# EAGLE design Radio2_Cm (EAGLE 7.5.0)
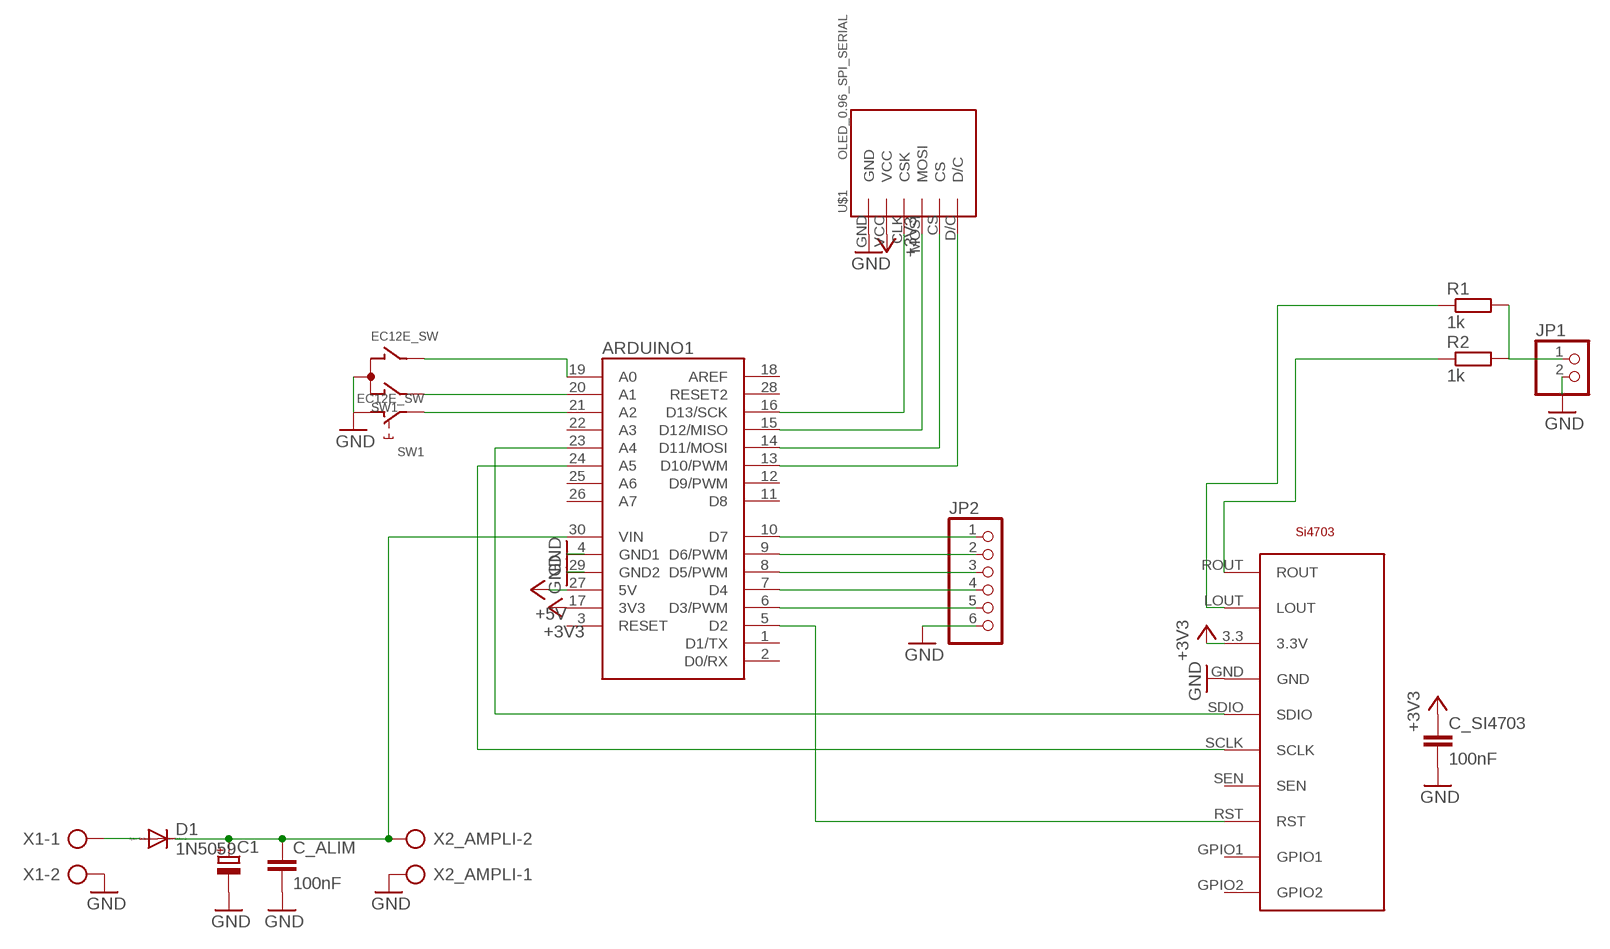
[diagram p0: schematic, sheet 1]

## Parts
ARDUINO1  ARDUINO_NANO  [ARDUINO_NANO]
C1  CPOL-EUE7.5-16  [E7,5-16]
C_ALIM  100nF  C-EU025-024X044  [C025-024X044]
C_SI4703  100nF  C-EU025-024X044  [C025-024X044]
D1  1N5059  [DO204-10]
JP1  PINHD-1X2  [1X02]
JP2  PINHD-1X6  [1X06]
R1  1k  R-EU_0207/10  [0207/10]
R2  1k  R-EU_0207/10  [0207/10]
SW1  EC12E_SW  [ALPS_EC12E_SW]
U$1  OLED_0.96_SPI_SERIAL  [OLED_9.96_SPI_SERIAL]
U$3  SI4703  [SI4703]
X1  AK300/2  [AK300/2]
X2_AMPLI  AK300/2  [AK300/2]

## Nets
+3V3: ARDUINO1.17(3V3) C_SI4703.1 U$1.VCC U$3.3.3(3.3V)
+5V: ARDUINO1.27(5V)
GND: ARDUINO1.4(GND1) ARDUINO1.29(GND2) C1.- C_ALIM.2 C_SI4703.2 JP1.2 JP2.6 SW1.C SW1.D U$1.GND U$3.GND X1.2 X2_AMPLI.1
N$1: ARDUINO1.16(D13/SCK) U$1.CLK(CSK)
N$2: ARDUINO1.5(D2) U$3.RST
N$3: ARDUINO1.6(D3/PWM) JP2.5
N$4: ARDUINO1.7(D4) JP2.4
N$5: ARDUINO1.8(D5/PWM) JP2.3
N$6: ARDUINO1.9(D6/PWM) JP2.2
N$7: ARDUINO1.15(D12/MISO) U$1.MOSI
N$8: ARDUINO1.14(D11/MOSI) U$1.CS
N$9: ARDUINO1.10(D7) JP2.1
N$10: ARDUINO1.23(A4) U$3.SDIO
N$11: D1.A X1.1
N$12: ARDUINO1.30(VIN) C1.+ C_ALIM.1 D1.C X2_AMPLI.2
N$13: R2.1 U$3.ROUT
N$14: R1.1 U$3.LOUT
N$17: JP1.1 R1.2 R2.2
N$20: ARDUINO1.13(D10/PWM) U$1.D/C
N$22: ARDUINO1.21(A2) SW1.E
N$25: ARDUINO1.20(A1) SW1.A
N$26: ARDUINO1.19(A0) SW1.B
N$55: ARDUINO1.24(A5) U$3.SCLK
Unconnected: ARDUINO1.1(D1/TX) ARDUINO1.2(D0/RX) ARDUINO1.3(RESET) ARDUINO1.11(D8) ARDUINO1.12(D9/PWM) ARDUINO1.18(AREF) ARDUINO1.22(A3) ARDUINO1.25(A6) ARDUINO1.26(A7) SW1.GND1(G) SW1.GND2(G) U$3.GPIO1 U$3.GPIO2 U$3.SEN

## Power pins joined to a net without a drawn wire
RESET2: ARDUINO1.28(RESET2)

## Library data of the parts
ARDUINO1 = arduino:ARDUINO_NANO: Arduino Nano I/O pin arrangement
C1 = rcl:CPOL-EU: POLARIZED CAPACITOR, European symbol
C_ALIM C_SI4703 = rcl:C-EU: CAPACITOR, European symbol
D1 = diode:1N5059: DIODE controlled avalanche rectifier
JP1 = pinhead:PINHD-1X2: PIN HEADER
JP2 = pinhead:PINHD-1X6: PIN HEADER
R1 R2 = rcl:R-EU_: RESISTOR, European symbol
SW1 = switch-alps:EC12E_SW: ALPS rotary Encoder EC12E series with switch; MPN: EC12E2424407; OC_FARNELL: 1520813; OC_NEWARK: 74M1068
U$1 = tft_1.8_1.44_oled_0.96:OLED_0.96_SPI_SERIAL
U$3 = Radio_mp3:SI4703
X1 X2_AMPLI = con-ptr500:AK300/2: CONNECTOR; OC_FARNELL: unknown; OC_NEWARK: unknown

## Board
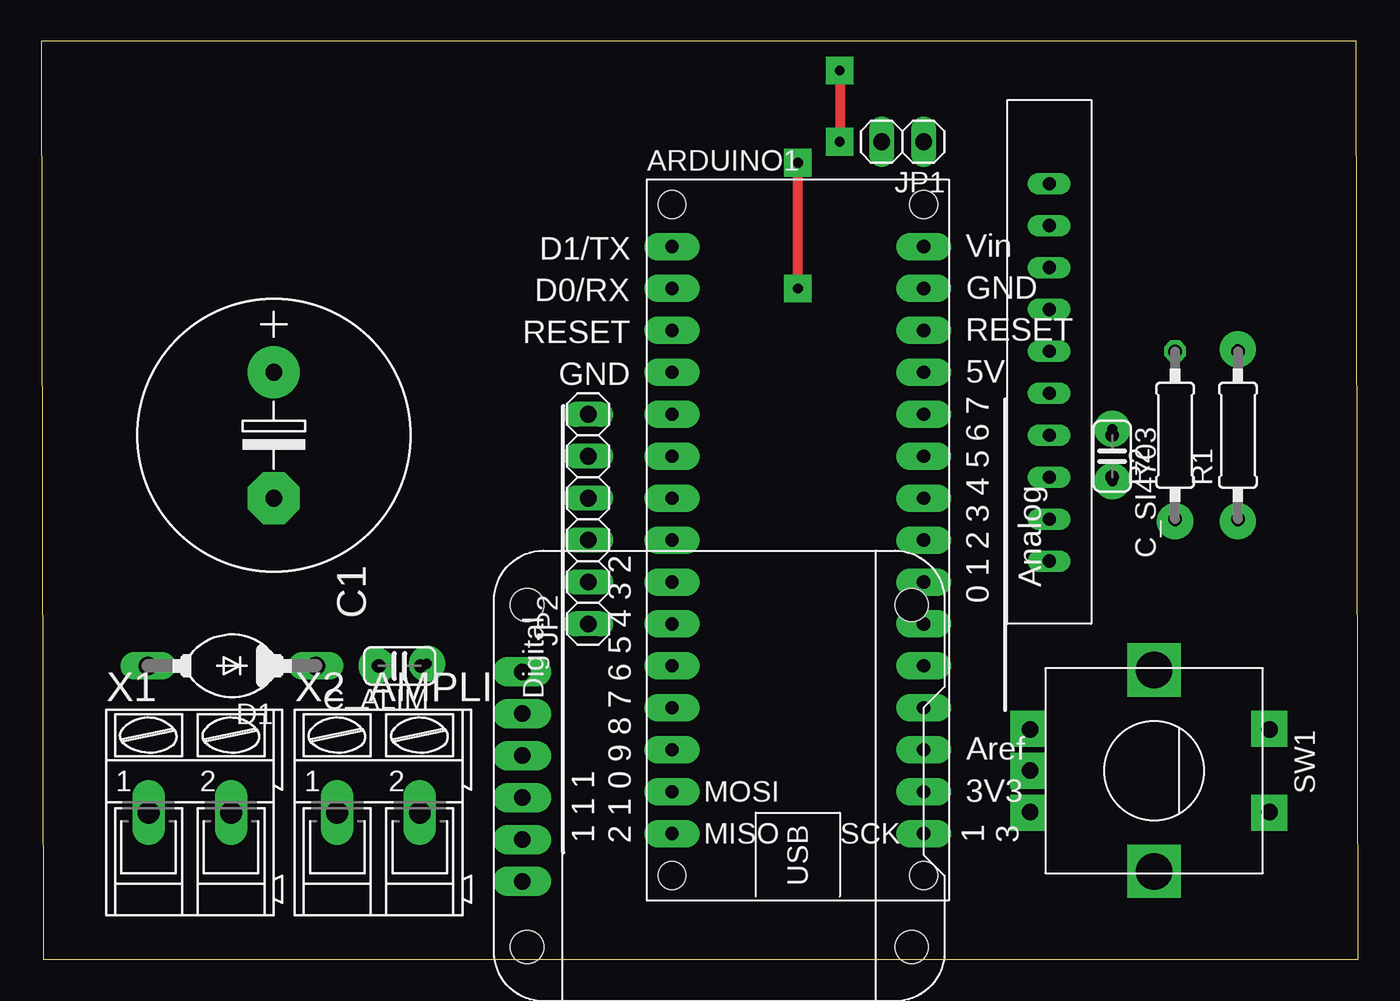
[diagram p1: board, top side]
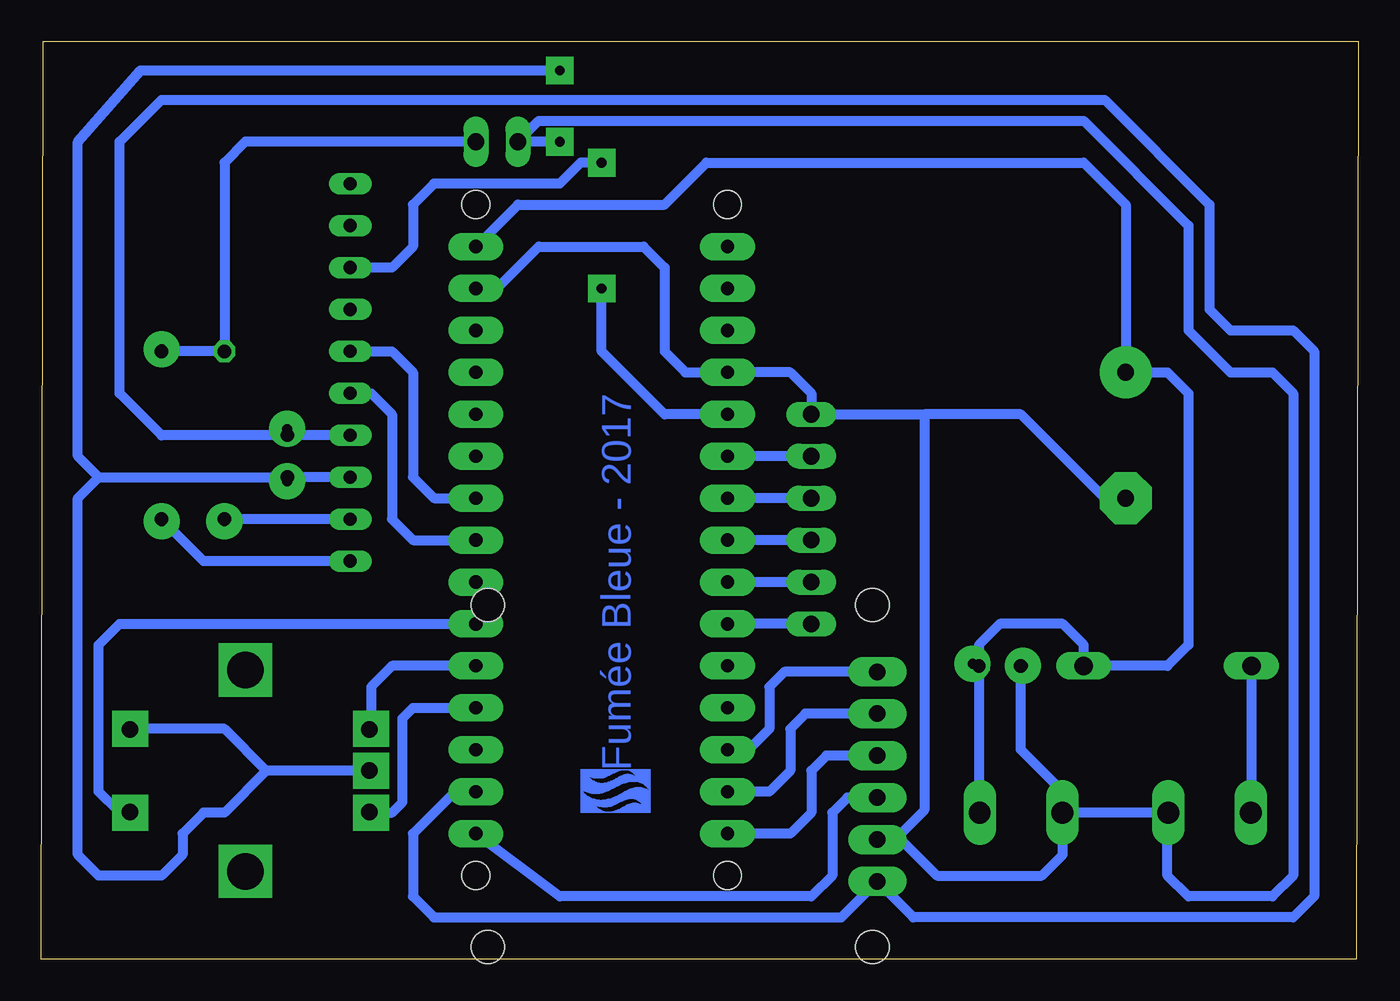
[diagram p2: board, bottom side, seen from below]

Size 79.81 x 55.62 mm. Coordinates in mm from the lower left corner, seen from the top.
Outline: 0.13,0 79.81,0 79.68,55.62 0,55.62 0.13,0
Copper layers (1*16): Top 0.035mm / dielectric 1.5mm / Bottom 0.035mm
Design rules "default": minimum track width 10mil, minimum drill 24mil, track to track 8mil, track to pad 8mil, pad to pad 8mil, via to via 8mil, smd to smd 8mil, copper to edge 40mil, drill to drill 8mil, minimum pad ring 10mil, minimum via ring 8mil, stop-mask expansion 4mil, vias tented up to drill 0mil, thermal gap 10mil

### Footprints (pad centres in the part's own frame; a part is rotated, then mirrored left to right if it is on the bottom)
ARDUINO_NANO = drill 0.8 pad 1.676 long: 1 0,-2.54; 2 0,-5.08; 3 0,-7.62; 4 0,-10.16; 5 0,-12.7; 6 0,-15.24; 7 0,-17.78; 8 0,-20.32; 9 0,-22.86; 10 0,-25.4; 11 0,-27.94; 12 0,-30.48; 13 0,-33.02; 14 0,-35.56; 15 0,-38.1; 16 15.24,-38.1; 17 15.24,-35.56; 18 15.24,-33.02; 19 15.24,-30.48; 20 15.24,-27.94; 21 15.24,-25.4; 22 15.24,-22.86; 23 15.24,-20.32; 24 15.24,-17.78; 25 15.24,-15.24; 26 15.24,-12.7; 27 15.24,-10.16; 28 15.24,-7.62; 29 15.24,-5.08; 30 15.24,-2.54 | hole 1.676: 0,0; 0,-40.64; 15.24,-40.64; 15.24,0
E7,5-16 = drill 1.016 pad 3.15: + -3.81,0 | drill 1.016 pad 3.15 octagon: - 3.81,0
C025-024X044 = drill 0.813 octagon: 1 -1.27,0; 2 1.27,0
DO204-10 = drill 1.118 long: A 5.08,0; C -5.08,0
1X02 = drill 1.016 long: 1 -1.27,0; 2 1.27,0
1X06 = drill 1.016 long: 1 -6.35,0; 2 -3.81,0; 3 -1.27,0; 4 1.27,0; 5 3.81,0; 6 6.35,0
0207/10 = drill 0.813 octagon: 1 -5.08,0; 2 5.08,0
ALPS_EC12E_SW = drill 1 square: A -2.5,-7.5; B 2.5,-7.5; C 0,-7.5; D -2.5,7; E 2.5,7 | drill 2.2 square: GND1 -6.1,0; GND2 6.1,0
OLED_9.96_SPI_SERIAL = drill 1 pad 1.778 long: CLK -1.63,11.63; CS 3.45,11.63; D/C 5.99,11.63; GND -4.17,11.63; MOSI 0.91,11.63; VCC -6.71,11.63 | hole 2: -10.67,-11.97; 10.03,-11.97; 10.03,11.33; -10.67,11.33
SI4703 = drill 0.8 long: 3.3 0,6.35; GND 0,8.89; GPIO1 0,-6.35; GPIO2 0,-8.89; LOUT 0,13.97; ROUT 0,11.43; RST 0,-3.81; SCLK 0,1.27; SDIO 0,3.81; SEN 0,-1.27
AK300/2 = drill 1.321 long: 1 -2.515,0; 2 2.489,0

### Placement (x,y rotation side)
ARDUINO1  38.23,45.72 0 top
C1  14.1,31.75 270 top
C_ALIM  21.72,17.78 180 top
C_SI4703  64.9,30.48 270 top
D1  11.56,17.78 180 top
JP1  52.2,49.53 180 top
JP2  33.15,26.67 90 top
R1  72.52,31.75 90 top
R2  68.71,31.75 90 top
SW1  67.44,11.43 270 top
U$1  40.77,11.43 90 top
U$2  [FB]  47.12,8.89 90 top
U$3  61.09,38.1 180 top
X1  9.02,8.89 0 top
X2_AMPLI  20.45,8.89 0 top

### Tracks (layer width: path | path; a pad name or v marks a point on that pad's centre or on a via)
+3V3
  Bottom 0.61: C_SI4703.1 U$3.3.3 72.52,31.75 75.06,34.29 75.06,49.53 72.52,52.07 15.37,52.07 9.02,45.72 9.02,39.37 7.75,38.1 3.94,38.1 2.67,36.83 2.67,3.81 3.94,2.54 26.96,2.54 U$1.VCC 31.32,2.54 56.01,2.54 57.28,3.81 57.28,7.62 54.74,10.16 ARDUINO1.17
GND  (via drill 0.6 pad 1.68)
  Top 0.61: v48.39,53.85 v48.39,49.53
  Bottom 0.61: ARDUINO1.29 52.2,40.64 49.66,43.18 43.31,43.18 42.04,41.91 42.04,36.83 40.77,35.56 ARDUINO1.4 34.42,35.56 33.15,34.29 JP2.6 26.29,33.02 | X2_AMPLI.1 17.93,10.18 20.45,12.7 C_ALIM.2 | C1.- 15.37,27.94 20.45,33.02 26.29,33.02 | 11.56,8.89 X2_AMPLI.1 | U$1.GND 28.07,7.26 | 28.07,7.26 27.71,7.26 25.53,5.08 19.18,5.08 17.91,6.35 17.91,8.87 X2_AMPLI.1 | SW1.C 66.17,11.43 | SW1.D 74.4,13.97 68.71,13.97 66.17,11.43 | 11.56,8.89 11.56,5.08 10.29,3.81 5.21,3.81 3.94,5.08 3.94,34.29 5.21,35.56 7.75,35.56 10.29,38.1 10.29,44.45 16.64,50.8 49.66,50.8 JP1.2 v48.39,49.53 | 11.56,8.89 X1.2 | 26.29,33.02 26.29,9.04 28.07,7.26 | 66.17,11.43 68.71,8.89 69.98,8.89 71.25,7.62 71.25,6.35 72.52,5.08 76.33,5.08 77.6,6.35 77.6,27.94 76.33,29.21 | 76.33,29.21 C_SI4703.2 U$3.GND | 76.33,29.21 77.6,30.48 77.6,49.53 73.79,53.85 v48.39,53.85
N$1
  Bottom 0.61: U$1.CLK 30.97,9.8 31.88,8.89 31.88,5.08 33.15,3.81 48.39,3.81 ARDUINO1.16
N$2  (via drill 0.6 pad 1.68)
  Top 0.61: v45.85,40.64 v45.85,48.26
  Bottom 0.61: ARDUINO1.5 42.04,33.02 45.85,36.83 v45.85,40.64 | v45.85,48.26 47.12,48.26 48.39,46.99 56.01,46.99 57.28,45.72 57.28,43.18 58.55,41.91 U$3.RST
N$3
  Bottom 0.61: JP2.5 ARDUINO1.6
N$4
  Bottom 0.61: JP2.4 ARDUINO1.7
N$5
  Bottom 0.61: JP2.3 ARDUINO1.8
N$6
  Bottom 0.61: JP2.2 ARDUINO1.9
N$7
  Bottom 0.61: U$1.MOSI 32.24,12.34 33.15,11.43 33.15,8.89 34.42,7.62 ARDUINO1.15
N$8
  Bottom 0.61: U$1.CS 33.51,14.88 34.42,13.97 34.42,11.43 35.69,10.16 ARDUINO1.14
N$9
  Bottom 0.61: JP2.1 ARDUINO1.10
N$10
  Bottom 0.61: U$3.SDIO 59.82,34.29 58.55,33.02 58.55,26.67 57.28,25.4 ARDUINO1.23
N$11
  Bottom 0.61: D1.A 6.48,8.91 X1.1
N$12
  Bottom 0.61: X2_AMPLI.2 22.99,8.89 C_ALIM.1 22.99,19.05 21.72,20.32 17.91,20.32 16.64,19.05 D1.C 11.56,17.78 10.29,19.05 10.29,34.29 11.56,35.56 C1.+ 14.1,45.72 16.64,48.26 39.5,48.26 42.04,45.72 50.93,45.72 ARDUINO1.30
N$13
  Bottom 0.61: U$3.ROUT R2.1
N$14
  Bottom 0.61: U$3.LOUT 69.98,24.13 R1.1
N$17
  Bottom 0.61: R1.2 R2.2 68.71,48.26 67.44,49.53 JP1.1
N$20
  Bottom 0.61: U$1.D/C 34.78,17.42 35.69,16.51 35.69,13.97 36.96,12.7 ARDUINO1.13
N$22
  Bottom 0.61: SW1.E 75.1,8.93 76.33,10.16 76.33,19.05 75.06,20.32 ARDUINO1.21
N$25
  Bottom 0.61: ARDUINO1.20 58.55,17.78 59.82,16.51 59.82,14.05 SW1.A
N$26  (via drill 0.6 pad 2.18)
  Bottom 0.61: SW1.B 59.9,8.89 v59.82,8.89 58.55,8.89 57.91,9.53 57.91,14.61 57.28,15.24 ARDUINO1.19
N$27  (via drill 0.6 pad 2.18)
  other vias: 74.42,8.89
N$28  (via drill 0.6 pad 2.18)
  other vias: 74.42,13.97
N$29  (via drill 0.6 pad 2.18)
  other vias: 59.82,11.43
N$30  (via drill 0.6 pad 2.18)
  other vias: 59.82,13.97
N$31  (via drill 0.6 pad 2.18)
  other vias: 72.52,36.96
N$32  (via drill 0.6 pad 2.18)
  other vias: 72.52,26.54
N$33  (via drill 0.6 pad 2.18)
  other vias: 68.71,26.54
N$34  (via drill 0.6 pad 2.18)
  other vias: 64.9,32.13
N$35  (via drill 0.6 pad 2.18)
  other vias: 64.9,28.96
N$43  (via drill 0.6 pad 2.18)
  other vias: 23.37,17.91
N$44  (via drill 0.6 pad 2.18)
  other vias: 20.32,17.78
N$55
  Bottom 0.61: U$3.SCLK 58.55,36.83 57.28,35.56 57.28,29.21 56.01,27.94 ARDUINO1.24

### Text on the board
Bottom: Fumée Bleue - 2017